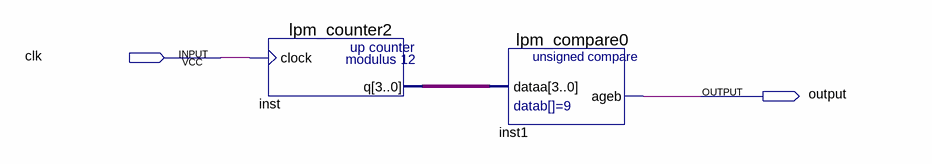
[diagram p0: schematic sheet]
// Quartus schematic pulsegen.bdf as structural Verilog: 2 symbols, 2 pins
module pulsegen (
  input  clk,
  output \output 
);

  wire [3:0] inst_q;

  lpm_counter2 inst (.clock(clk), .q(inst_q));
  lpm_compare0 inst1 (.dataa(inst_q), .ageb(\output ));
endmodule
